# Altium schematic sheet CPU.SchDoc: CPU
size 420 x 297 mm; Author: G.K.; CompanyName: WUT; DrawnBy: G.K.; Organization: WUT ISE; Address1: Warsaw Univeristy of Technology; Address2: Nowowiejska 15/19; DocumentNumber: 2; Revision: -; SheetNumber: 2; SheetTotal: 5; EDA_Number: ARTIQ; Projet: 8 Channel RF Power Amplifier; ModifiedBy: -; CreateDate: XX/XX/XXXX; CheckedDate: -; Title2: controller; DivGrp: ISE; Designer: G.K.; ModifiedDate: -; ProjectName: 8 Channel RF Power Amplifier
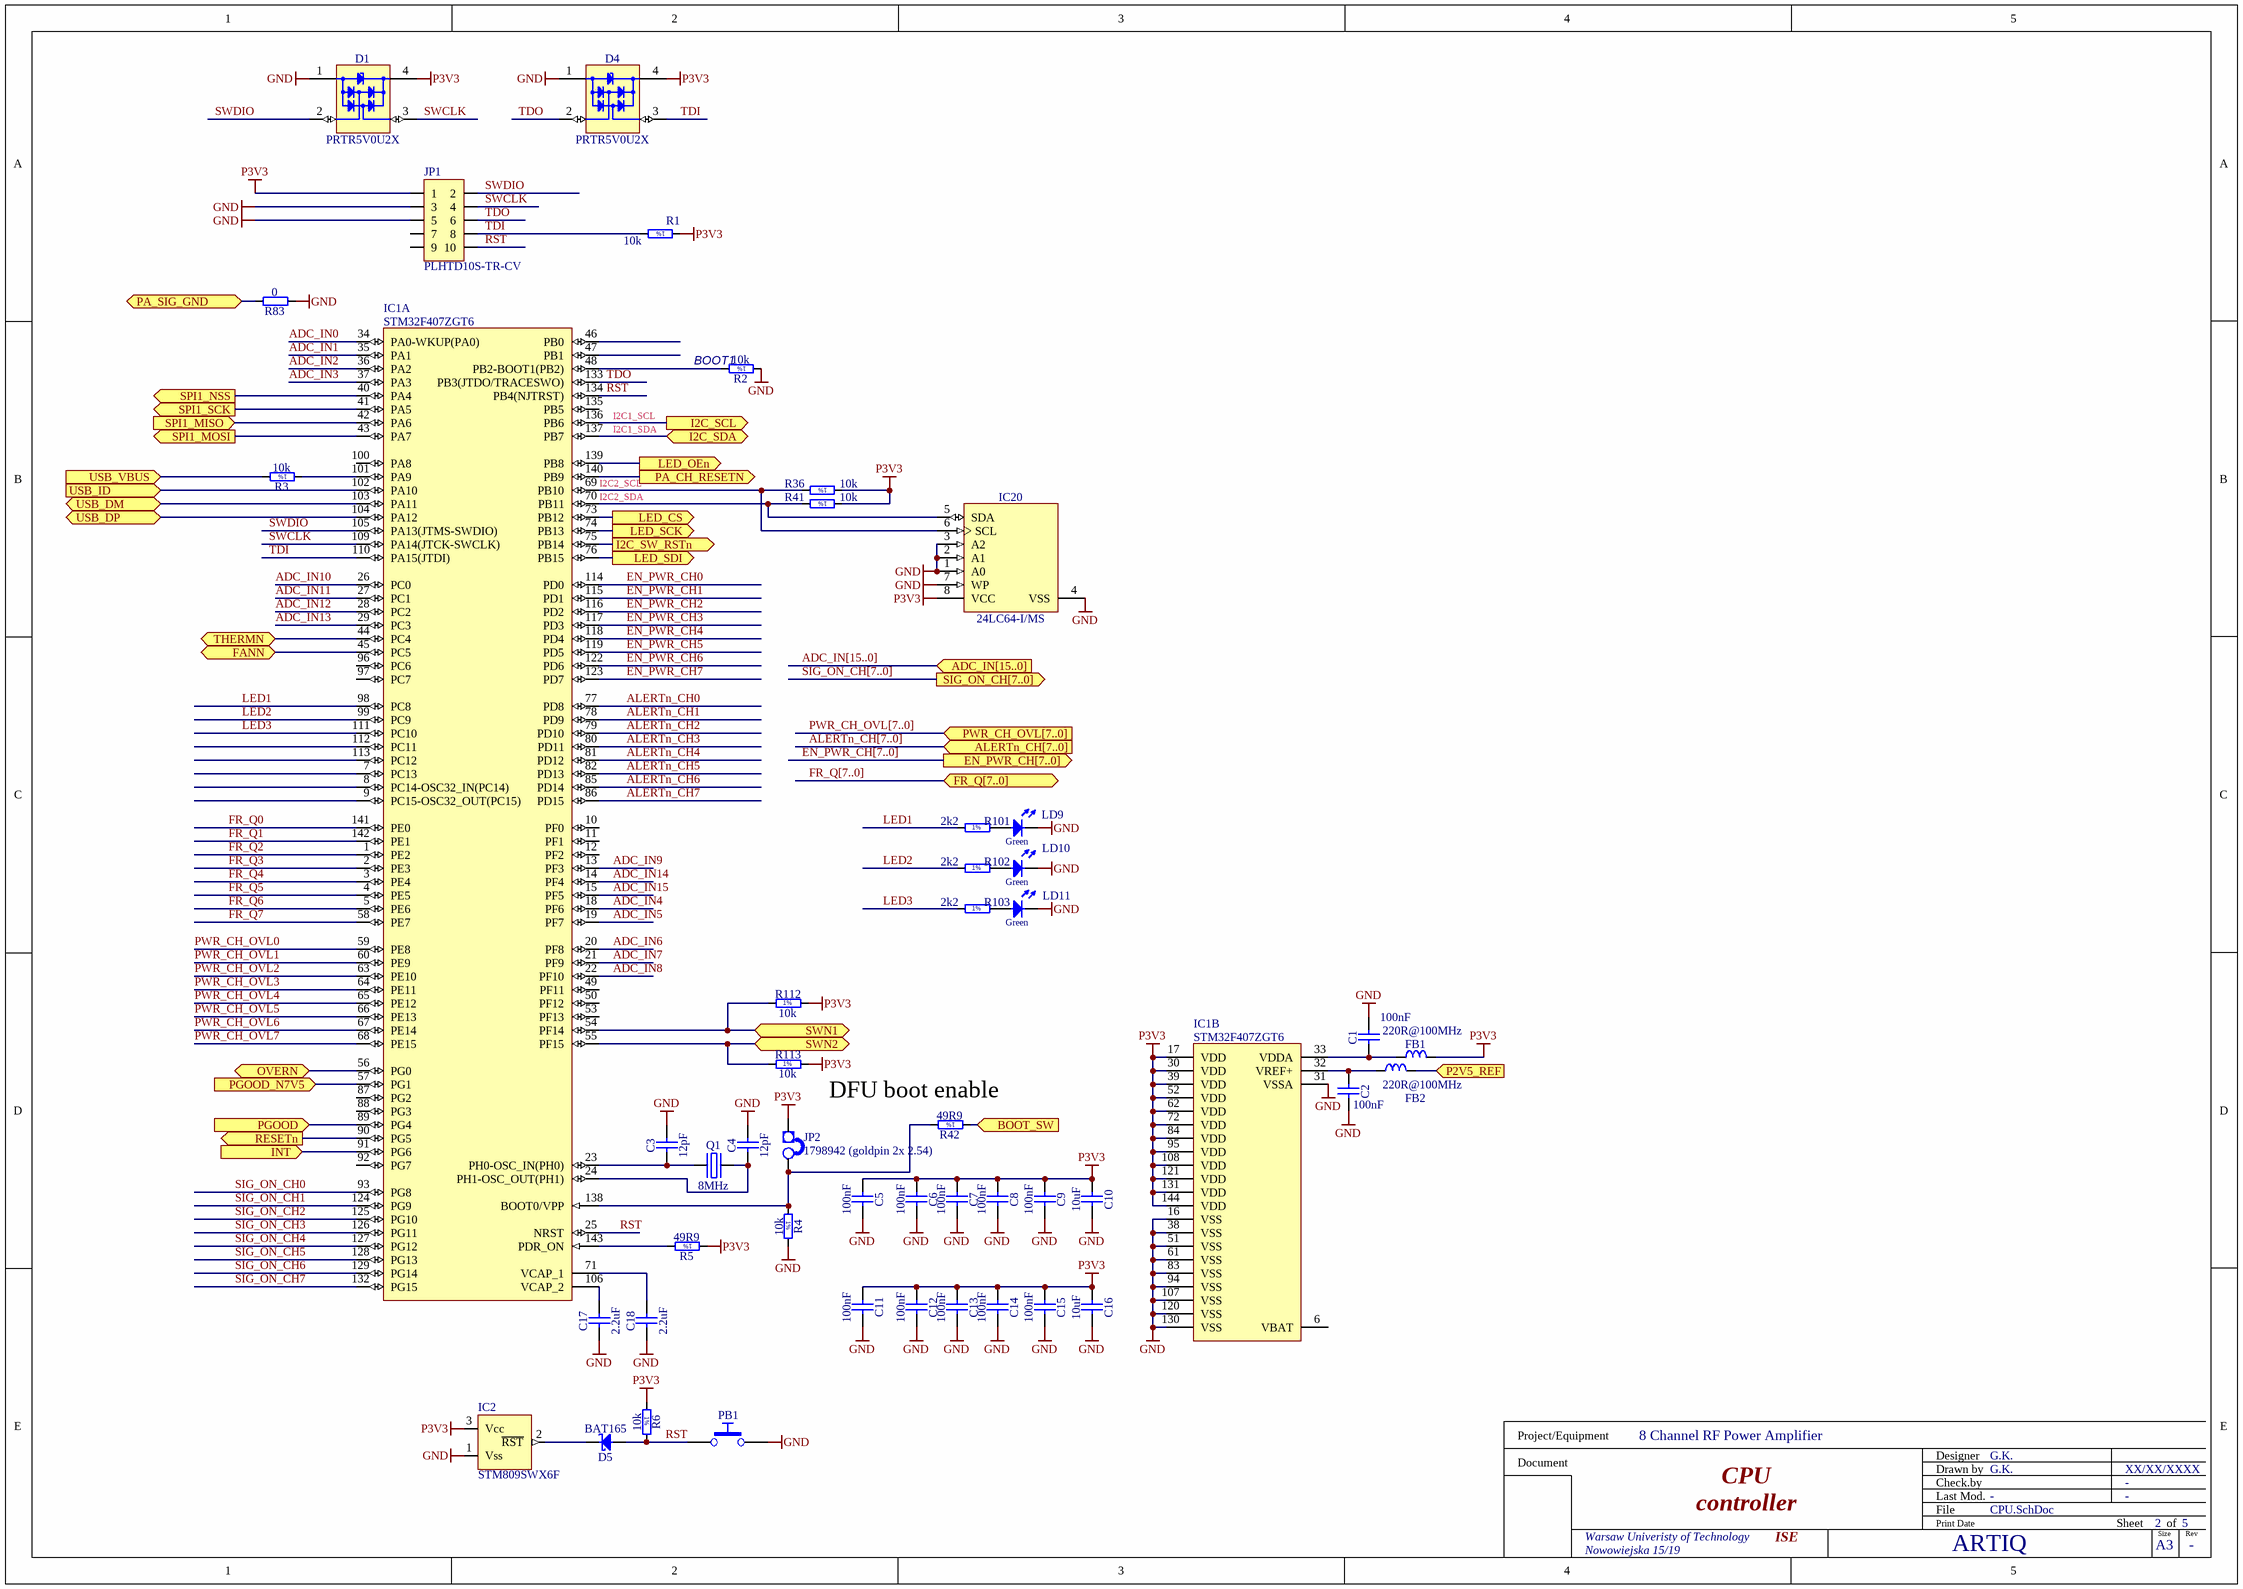
[diagram p0: CPU.SchDoc]

## Parts
C1  100nF  [CAPC1005X55N]
C2  100nF  [CAPC1005X55N]
C3  12pF  [CAPC1005X55N]
C4  12pF  [CAPC1005X55N]
C5  100nF  [CAPC1005X55N]
C6  100nF  [CAPC1005X55N]
C7  100nF  [CAPC1005X55N]
C8  100nF  [CAPC1005X55N]
C9  100nF  [CAPC1005X55N]
C10  10uF  [CAPC2012X135N]
C11  100nF  [CAPC1005X55N]
C12  100nF  [CAPC1005X55N]
C13  100nF  [CAPC1005X55N]
C14  100nF  [CAPC1005X55N]
C15  100nF  [CAPC1005X55N]
C16  10uF  [CAPC2012X135N]
C17  2.2uF  [CAPC1608X90N]
C18  2.2uF  [CAPC1608X90N]
D1  PRTR5V0U2X  [SOT190P230X110-4N]
D4  PRTR5V0U2X  [SOT190P230X110-4N]
D5  BAT165  [SOD2512X110N]
FB1  220R@100MHz  [INDC2012X105N]
FB2  220R@100MHz  [INDC2012X105N]
IC1  STM32F407ZGT6  [QFP50P2200X2200X160-144N]  (parts A,B of 2)
IC2  STM809SWX6F  [SOT-23]
IC20  24LC64-I/MS  [SOP65P490X110-8N]
JP1  PLHTD10S-TR-CV  [PLHTD10S-TR-CV]
JP2  1798942 (goldpin 2x 2.54)  [jump]
LD9  Green  [LED_OSRAM_LGL29K]  (value not drawn)
LD10  Green  [LED_OSRAM_LGL29K]  (value not drawn)
LD11  Green  [LED_OSRAM_LGL29K]  (value not drawn)
PB1  Push Button  [PB_TYCO_FSMSM]  (value not drawn)
Q1  8MHz  [XTAL_TXC_7A]
R1  10k  [RESC1005X40N]
R2  10k  [RESC1005X40N]
R3  10k  [RESC1005X40N]
R4  10k  [RESC1005X40N]
R5  49R9  [RESC1005X40N]
R6  10k  [RESC1005X40N]
R36  10k  [RESC1005X40N]
R41  10k  [RESC1005X40N]
R42  49R9  [RESC1005X40N]
R83  0  [RESC1005X40N]
R101  2k2  [RESC1005X40N]
R102  2k2  [RESC1005X40N]
R103  2k2  [RESC1005X40N]
R112  10k  [RESC1005X40N]
R113  10k  [RESC1005X40N]

## Ports
ADC_IN[15..0] (in), ALERTn_CH[7..0] (in), BOOT_SW (in), EN_PWR_CH[7..0] (out), FANN, FR_Q[7..0] (bidir), I2C_SCL (out), I2C_SDA (bidir), I2C_SW_RSTn (out), INT (in), LED_CS (out), LED_OEn (out), LED_SCK (out), LED_SDI (out), OVERN, P2V5_REF (in), PA_CH_RESETN (out), PA_SIG_GND (bidir), PGOOD (in), PGOOD_N7V5 (in), PWR_CH_OVL[7..0] (in), RESETn (out), SIG_ON_CH[7..0] (out), SPI1_MISO (in), SPI1_MOSI (out), SPI1_NSS (out), SPI1_SCK (out), SWN1 (bidir), SWN2 (bidir), THERMN, USB_DM (bidir), USB_DP (bidir), USB_ID (in), USB_VBUS (in)

## Nets
GND: C1.2 C2.2 C3.2 C4.2 C5.2 C6.2 C7.2 C8.2 C9.2 C10.2 C11.2 C12.2 C13.2 C14.2 C15.2 C16.2 C17.1 C18.1 D1.1(GND) D4.1(GND) IC1.16(VSS) IC1.31(VSSA) IC1.38(VSS) IC1.51(VSS) IC1.61(VSS) IC1.83(VSS) IC1.94(VSS) IC1.107(VSS) IC1.120(VSS) IC1.130(VSS) IC2.1(Vss) IC20.1(A0) IC20.2(A1) IC20.3(A2) IC20.4(VSS) IC20.7(WP) JP1.3 JP1.5 LD9.1(C) LD10.1(C) LD11.1(C) PB1.2 R2.1 R4.2 R83.1
P3V3: C5.1 C6.1 C7.1 C8.1 C9.1 C10.1 C11.1 C12.1 C13.1 C14.1 C15.1 C16.1 D1.4(VCC) D4.4(VCC) FB1.2 IC1.17(VDD) IC1.30(VDD) IC1.39(VDD) IC1.52(VDD) IC1.62(VDD) IC1.72(VDD) IC1.84(VDD) IC1.95(VDD) IC1.108(VDD) IC1.121(VDD) IC1.131(VDD) IC1.144(VDD) IC2.3(Vcc) IC20.8(VCC) JP1.1 JP2.1(E1) R1.1 R5.1 R6.1 R36.1 R41.1 R112.2 R113.2
ADC_IN0: IC1.34(PA0-WKUP(PA0))
ADC_IN1: IC1.35(PA1)
ADC_IN2: IC1.36(PA2)
ADC_IN3: IC1.37(PA3)
ADC_IN4: IC1.18(PF6)
ADC_IN5: IC1.19(PF7)
ADC_IN6: IC1.20(PF8)
ADC_IN7: IC1.21(PF9)
ADC_IN8: IC1.22(PF10)
ADC_IN9: IC1.13(PF3)
ADC_IN10: IC1.26(PC0)
ADC_IN11: IC1.27(PC1)
ADC_IN12: IC1.28(PC2)
ADC_IN13: IC1.29(PC3)
ADC_IN14: IC1.14(PF4)
ADC_IN15: IC1.15(PF5)
ALERTn_CH0: IC1.77(PD8)
ALERTn_CH1: IC1.78(PD9)
ALERTn_CH2: IC1.79(PD10)
ALERTn_CH3: IC1.80(PD11)
ALERTn_CH4: IC1.81(PD12)
ALERTn_CH5: IC1.82(PD13)
ALERTn_CH6: IC1.85(PD14)
ALERTn_CH7: IC1.86(PD15)
BOOT_SW: R42.1 ; port BOOT_SW
EN_PWR_CH0: IC1.114(PD0)
EN_PWR_CH1: IC1.115(PD1)
EN_PWR_CH2: IC1.116(PD2)
EN_PWR_CH3: IC1.117(PD3)
EN_PWR_CH4: IC1.118(PD4)
EN_PWR_CH5: IC1.119(PD5)
EN_PWR_CH6: IC1.122(PD6)
EN_PWR_CH7: IC1.123(PD7)
FANN: IC1.45(PC5) ; port FANN
FR_Q0: IC1.141(PE0)
FR_Q1: IC1.142(PE1)
FR_Q2: IC1.1(PE2)
FR_Q3: IC1.2(PE3)
FR_Q4: IC1.3(PE4)
FR_Q5: IC1.4(PE5)
FR_Q6: IC1.5(PE6)
FR_Q7: IC1.58(PE7)
I2C_SCL: IC1.136(PB6) ; port I2C_SCL
I2C_SDA: IC1.137(PB7) ; port I2C_SDA
I2C_SW_RSTn: IC1.75(PB14) ; port I2C_SW_RSTn
INT: IC1.91(PG6) ; port INT
LED1: IC1.98(PC8) R101.1
LED2: IC1.99(PC9) R102.1
LED3: IC1.111(PC10) R103.1
LED_CS: IC1.73(PB12) ; port LED_CS
LED_OEn: IC1.139(PB8) ; port LED_OEn
LED_SCK: IC1.74(PB13) ; port LED_SCK
LED_SDI: IC1.76(PB15) ; port LED_SDI
OVERN: IC1.56(PG0) ; port OVERN
P2V5_REF: FB2.2 ; port P2V5_REF
PA_CH_RESETN: IC1.140(PB9) ; port PA_CH_RESETN
PA_SIG_GND: R83.2 ; port PA_SIG_GND
PGOOD: IC1.89(PG4) ; port PGOOD
PGOOD_N7V5: IC1.57(PG1) ; port PGOOD_N7V5
PWR_CH_OVL0: IC1.59(PE8)
PWR_CH_OVL1: IC1.60(PE9)
PWR_CH_OVL2: IC1.63(PE10)
PWR_CH_OVL3: IC1.64(PE11)
PWR_CH_OVL4: IC1.65(PE12)
PWR_CH_OVL5: IC1.66(PE13)
PWR_CH_OVL6: IC1.67(PE14)
PWR_CH_OVL7: IC1.68(PE15)
RESETn: IC1.90(PG5) ; port RESETn
RST: D5.2(A) IC1.25(NRST) IC1.134(PB4(NJTRST)) JP1.10 PB1.1 R6.2
SIG_ON_CH0: IC1.93(PG8)
SIG_ON_CH1: IC1.124(PG9)
SIG_ON_CH2: IC1.125(PG10)
SIG_ON_CH3: IC1.126(PG11)
SIG_ON_CH4: IC1.127(PG12)
SIG_ON_CH5: IC1.128(PG13)
SIG_ON_CH6: IC1.129(PG14)
SIG_ON_CH7: IC1.132(PG15)
SPI1_MISO: IC1.42(PA6) ; port SPI1_MISO
SPI1_MOSI: IC1.43(PA7) ; port SPI1_MOSI
SPI1_NSS: IC1.40(PA4) ; port SPI1_NSS
SPI1_SCK: IC1.41(PA5) ; port SPI1_SCK
SWCLK: D1.3(I/O2) IC1.109(PA14(JTCK-SWCLK)) JP1.4
SWDIO: D1.2(I/O1) IC1.105(PA13(JTMS-SWDIO)) JP1.2
SWN1: IC1.54(PF14) R112.1 ; port SWN1
SWN2: IC1.55(PF15) R113.1 ; port SWN2
TDI: D4.3(I/O2) IC1.110(PA15(JTDI)) JP1.8 R1.2
TDO: D4.2(I/O1) IC1.133(PB3(JTDO/TRACESWO)) JP1.6
THERMN: IC1.44(PC4) ; port THERMN
USB_DM: IC1.103(PA11) ; port USB_DM
USB_DP: IC1.104(PA12) ; port USB_DP
USB_ID: IC1.102(PA10) ; port USB_ID
USB_VBUS: R3.2 ; port USB_VBUS
NetC1_1: C1.1 FB1.1 IC1.33(VDDA)
NetC2_1: C2.1 FB2.1 IC1.32(VREF+)
NetC3_1: C3.1 IC1.23(PH0-OSC_IN(PH0)) Q1.1(OSC1)
NetC4_1: C4.1 IC1.24(PH1-OSC_OUT(PH1)) Q1.2(OSC2)
NetC17_2: C17.2 IC1.106(VCAP_2)
NetC18_2: C18.2 IC1.71(VCAP_1)
NetD5_1: D5.1(C) IC2.2(~{RST})
NetIC1_48: IC1.48(PB2-BOOT1(PB2)) R2.2
NetIC1_69: IC1.69(PB10) IC20.6(SCL) R36.2
NetIC1_70: IC1.70(PB11) IC20.5(SDA) R41.2
NetIC1_101: IC1.101(PA9) R3.1
NetIC1_138: IC1.138(BOOT0/VPP) JP2.2(E2) R4.1 R42.2
NetIC1_143: IC1.143(PDR_ON) R5.2
NetLD9_2: LD9.2(A) R101.2
NetLD10_2: LD10.2(A) R102.2
NetLD11_2: LD11.2(A) R103.2

Not connected (* = marked no-connect by the designer): IC1 6(VBAT) 7(PC13) 8(PC14-OSC32_IN(PC14)) 9(PC15-OSC32_OUT(PC15)) 10(PF0) 11(PF1) 12(PF2) 46(PB0) 47(PB1) 49(PF11) 50(PF12) 53(PF13) 87(PG2) 88(PG3) 92(PG7) 96(PC6) 97(PC7) 100(PA8) 112(PC11) 113(PC12) 135(PB5); JP1 7 9

## Buses and harness runs
bus ADC_IN[15..0] = port ADC_IN[15..0]
bus ALERTn_CH[7..0] = port ALERTn_CH[7..0]
bus EN_PWR_CH[7..0] = port EN_PWR_CH[7..0]
bus FR_Q[7..0] = port FR_Q[7..0]
bus PWR_CH_OVL[7..0] = port PWR_CH_OVL[7..0]
bus SIG_ON_CH[7..0] = port SIG_ON_CH[7..0]

## Notes on the sheet
- (near R2) BOOT1
- (near IC1) I2C1_SCL
- (near IC1) I2C1_SDA
- (near IC1) I2C2_SCL
- (near IC1) I2C2_SDA
- DFU boot enable
- Project/Equipment
- Document
- Designer
- Drawn by
- Check.by
- File
- Last Mod.
- Print Date
- Sheet
- Size
- A3
- of
- Rev
- (in symbol R0402_2K2_1%_0.0625W_100PPM) 1%
- (in symbol R0402_10K_1%_0.0625W_100PPM) 1%
- (in symbol R0402_49R9_1%_0.0625W_100PPM) 1%

## Library data of the parts
C1 C2 C5-C9 C11-C15 = CC0402_100NF_16V_10%_X7R: Non-polarised capacitor; Part Description: SMD Multilayer Chip Ceramic Capacitor; Manufacturer: GENERIC; Manufacturer1 Part Number: GRM155R71C104KA88D; Voltage: 16V; TC: X7R; Tolerance: ±10%; Part Number: CC0402_100NF_16V_10%_X7R; Component Kind: Standard; Component Type: Standard; Pin Count: 2; Value: 100nF; Status: Not Recommended; Manufacturer Part Number: CC0402_100NF_16V_10%_X7R; Case: 0402; Mounted: Yes; Socket: No; SMD: Yes; Manufacturer1 Example: MURATA; Manufacturer1 ComponentHeight: 0.55mm; HelpURL: \\cern.ch\dfs\Applications\Altium\Datasheets\CC0402_X7R_MURATA_GRM.pdf; Author: CERN DEM JLC; CreateDate: 05.12.2013; LatestRevisionDate: 03.12.2007; Sense: No
C3 C4 = CC0402_12PF_50V_5%_C0G: Non-polarised capacitor; Part Description: SMD Multilayer Chip Ceramic Capacitor; Manufacturer: GENERIC; Manufacturer1 Part Number: C0402C120J5GACTU; Voltage: 50V; TC: C0G/NP0; Tolerance: ±5%; Part Number: CC0402_12PF_50V_5%_C0G; Component Kind: Standard; Component Type: Standard; Pin Count: 2; Value: 12pF; Status: Preferred; Manufacturer Part Number: CC0402_12PF_50V_5%_C0G; Case: 0402; Mounted: Yes; Socket: No; SMD: Yes; Sense: No; Manufacturer1 Example: KEMET; Manufacturer1 ComponentHeight: 0.55mm; HelpURL: \\cern.ch\dfs\Applications\Altium\Datasheets\CC0805_C0G_KEMET_(Commercial Grade).pdf; Author: CERN DEM JLC; CreateDate: 04.10.2016; LatestRevisionDate: 04.10.2016
C10 C16 = CC0805_10UF_16V_10%_X5R: Non-polarised capacitor; Part Description: SMD Multilayer Chip Ceramic Capacitor; Manufacturer: GENERIC; Manufacturer1 Part Number: C0805C106K4PAC; Voltage: 16V; TC: X5R; Tolerance: ±10%; Part Number: CC0805_10UF_16V_10%_X5R; Component Kind: Standard; Component Type: Standard; Pin Count: 2; Value: 10uF; Status: Preferred; Manufacturer Part Number: CC0805_10UF_16V_10%_X5R; Case: 0805; Mounted: Yes; Socket: No; SMD: Yes; Manufacturer1 Example: KEMET; Manufacturer1 ComponentHeight: 1.4mm; HelpURL: \\cern.ch\dfs\Applications\Altium\Datasheets\CC1206_X5R_KEMET.pdf; Author: CERN DEM JLC; CreateDate: 03.12.2007; LatestRevisionDate: 03.12.2007; Sense: No
C17 C18 = CC0603_2.2UF_10V_20%_X7R: Non-polarised capacitor; Part Description: SMD Multilayer Chip Ceramic Capacitor; Manufacturer: GENERIC; Manufacturer1 Part Number: LMK107B7225MA-T; Voltage: 10V; TC: X7R; Tolerance: ±20%; Part Number: CC0603_2.2UF_10V_20%_X7R; Component Kind: Standard; Component Type: Standard; Pin Count: 2; Value: 2.2uF; Status: Not Recommended; Manufacturer Part Number: CC0603_2.2UF_10V_20%_X7R; Case: 0603; Mounted: Yes; Socket: No; SMD: Yes; Sense: No; Manufacturer1 Example: TAIYO YUDEN; Manufacturer1 ComponentHeight: 0.9mm; HelpURL: \\cern.ch\dfs\Applications\Altium\Datasheets\CC0603_X7R_TAIYO-YUDEN_HIGH-VALUE.pdf; Author: CERN DEM JLC; CreateDate: 22.06.2011; LatestRevisionDate: 27.06.2011
D1 D4 = PRTR5V0U2X: Ultra Low Capacitance Double Rail-to-Rail ESD Protection Diode; Part Description: Ultra Low Capacitance (1pF) Double Rail-to-Rail ESD Protection Diode (8kV); Manufacturer: NXP SEMICONDUCTORS; Voltage: 5.5V; PressFit: No; Bonding: No; Part Number: PRTR5V0U2X; Component Kind: Standard; Component Type: Standard; Device: PRTR5V0U2X; PackageDescription: SOT143B, SOT, 1.90mm Pitch; 4 Pin, 1.30mm W X 2.90mm L X 1.10mm H body, IPC Medium Density; Manufacturer Part Number: PRTR5V0U2X; Pin Count: 4; Case: SOT143B; Mounted: Yes; Socket: No; SMD: Yes; Sense: No; ComponentHeight: 1.1mm; HelpURL: \\cern.ch\dfs\Applications\Altium\Datasheets\PRTR5V0U2X.pdf; Author: CERN DEM JLC; CreateDate: 22.03.2011; LatestRevisionDate: 22.03.2011
D5 = BAT165: Schottky Diode; Part Description: Medium Power AF Schottky Diode; Manufacturer: INFINEON; Voltage: 40V; Power: 750mA; PressFit: No; Bonding: No; Part Number: BAT165; Component Kind: Standard; Component Type: Standard; Device: BAT165; PackageDescription: Small Outline Diode Flat Lead (SOD-323), 1.70mm W X 1.25mm L X 1.10mm H body,  IPC Medium Density; Manufacturer Part Number: BAT165; Pin Count: 2; Case: SOD323; Mounted: Yes; Socket: No; SMD: Yes; Sense: No; ComponentHeight: 1.1mm; HelpURL: \\cern.ch\dfs\Applications\Altium\Datasheets\BAT165.pdf; Author: CERN DEM JLC; CreateDate: 12.11.2014; LatestRevisionDate: 12.11.2014
FB1 FB2 = IND0805_MURATA_BLM21PG221SN1D: Inductor; Part Description: SMD EMIFIL Suppression Chip Ferrite Bead; Manufacturer: MURATA; Power: 2A; Resistance: 0.05R; Tolerance: ±25%; Table: Inductors SMD; Part Number: IND0805_MURATA_BLM21PG221SN1D; Component Kind: Standard; Component Type: Standard; Pin Count: 2; Value: 220R@100MHz; Status: None; Manufacturer Part Number: BLM21PG221SN1D; Case: 0805; Mounted: Yes; Socket: No; SMD: Yes; ComponentHeight: 1.05mm; HelpURL: \\cern.ch\dfs\Applications\Altium\Datasheets\IND0402_MURATA_BLM21P.pdf; Author: CERN DEM JLC; CreateDate: 2010-01-25; LatestRevisionDate: 2010-01-25
IC1 = STM32F407ZGT6: ARM Cortex-M4 32-bit MCU+FPU, 210 DMIPS, 1024 kB Flash, 192 kB Internal RAM, 114 I/Os, 144-pin LQFP, -40 to 85 degC, Tray; Part Description: ARM Cortex-M4 32b MCU+FPU, 210DMIP, 1024 kB Flash, 192+4 kB RAM, Camera, 114 I/Os, 144-pin LQFP, Industrial Grade; Manufacturer: ST MICROELECTRONICS; PressFit: No; Bonding: No; Part Number: STM32F407ZGT6; Component Kind: Standard; Component Type: Standard; Device: STM32F407ZGT6; PackageDescription: QFP, 0.50mm Pitch, Square; 144 Pin, 20.00mm L X 20.00mm W X 1.60mm H Body, IPC Medium Density; Manufacturer Part Number: STM32F407ZGT6; Pin Count: 144; Case: QFP144; Mounted: Yes; Socket: No; SMD: Yes; Sense: No; ComponentHeight: 1.6mm; HelpURL: \\cern.ch\dfs\Applications\Altium\Datasheets\STM32F407ZGT6.pdf; Author: CERN DEM MR; CreateDate: 14.07.2016; LatestRevisionDate: 14.07.2016
IC2 = VMON_STM809: 2.93V  Reset circuit
IC20 = 24LC64-I/MS: 64K I2C Serial EEPROM; Part Description: 2.5V-5.5V, 64K (8K x 8-bit) I2C Serial EEPROM; Manufacturer: MICROCHIP TECHNOLOGY; PressFit: No; Bonding: No; Part Number: 24LC64-I/MS; Component Kind: Standard; Component Type: Standard; Device: 24LC64-I/MS; PackageDescription: SOP, 0.65mm pitch; 8 pin, 3.00mm W X 3.00mm L X 1.10mm H body, IPC Medium Density; Manufacturer Part Number: 24LC64-I/MS; Pin Count: 8; Case: MSOP8; Mounted: Yes; Socket: No; SMD: Yes; Sense: No; ComponentHeight: 1.1mm; HelpURL: \\cern.ch\dfs\Applications\Altium\Datasheets\24LC64-I-MS.pdf; Author: CERN DEM JLC; CreateDate: 24.01.2011; LatestRevisionDate: 24.01.2011
JP1 = CON_2x5 1.27 SMT Male: 1.27 mm dual row goldpin (Maritex)
JP2 = JUMPER: Supplier 1: Farnell; Supplier Part Number 1: 1798942
LD9-LD11 = LED_OSRAM_LG L29K-G2J1-24-Z: LED Green 1C 2A; Part Description: Surface Mount Green LED (0603 Case); Manufacturer: OSRAM; PressFit: No; Bonding: No; Part Number: LED_OSRAM_LG L29K-G2J1-24-Z; Component Kind: Standard; Component Type: Standard; Color: Green; PackageDescription: Green Chip LED, 2-Leads, Body 1.7x0.8mm, IPC Medium Density; Manufacturer Part Number: LG L29K-G2J1-24-Z; Pin Count: 2; Case: 0603; Mounted: Yes; Socket: No; SMD: Yes; Sense: No; ComponentHeight: 0.67mm; HelpURL: \\cern.ch\dfs\Applications\Altium\Datasheets\LED_OSRAM_LGL29K.pdf; Author: CERN DEM JLC; CreateDate: 24.04.2012; LatestRevisionDate: 24.04.2012
PB1 = PB_TYCO_FSMSM: Push-Button Switch SPDT; Part Description: 12VDC 50mA SPST Tactile  Push-Button Switch; Manufacturer: TYCO ELECTRONICS; Manufacturer Part Number: FSMSM or 1437566-3; PressFit: No; Part Number: PB_TYCO_FSMSM; Component Kind: Standard; Component Type: Standard; Pin Count: 2; PackageDescription: Body 3.5x6.0mm, Pushbutton Switch,  TYCO ALCOSWITCH FSMSM Serie; Family: Push Button; Mounted: Yes; Socket: No; SMD: Yes; Sense: No; Status: None; ComponentHeight: 4.3mm; HelpURL: \\cern.ch\dfs\Applications\Altium\Datasheets\PB_TYCO_FSMSM.pdf; Author: CERN DEM JLC; CreateDate: 30.06.2008; LatestRevisionDate: 21.06.2012
Q1 = XTAL_8MHZ_TXC_7A-8.000MAAE-T: Quartz Crystal; Part Description: Tolerance: ±30ppm, Stability: ±30ppm, -20°C to +70°C, 12pF, SMD Glass Seam Sealing Crystal, 7A Series; Manufacturer: TXC CORPORATION; PressFit: No; Bonding: No; Part Number: XTAL_8MHZ_TXC_7A-8.000MAAE-T; Component Kind: Standard; Component Type: Standard; PackageDescription: 2 Pins, 3.2x5mm, SMD Glass Seam Sealing Crystal, 7A Serie; Value: 8MHz; Manufacturer Part Number: 7A-8.000MAAE-T; Pin Count: 2; Mounted: Yes; Socket: No; SMD: Yes; Sense: No; ComponentHeight: 1.2mm; HelpURL: \\cern.ch\dfs\Applications\Altium\Datasheets\XTAL_TXC_7A.pdf; Author: CERN DEM JLC; CreateDate: 09.10.2014; LatestRevisionDate: 12.11.2014
R1-R4 R6 R36 R41 R112 R113 = R0402_10K_1%_0.0625W_100PPM: Resistor - 1%; Part Description: General Purpose Thick Film Chip Resistor; Manufacturer: GENERIC; Manufacturer1 Part Number: 232270671003L; TC: ±100ppm/°C; Table: Resistors SMD; Part Number: R0402_10K_1%_0.0625W_100PPM; Component Kind: Standard; Component Type: Standard; Pin Count: 2; Value: 10k; Status: Not recommended; Power: 0.0625W; Tolerance: ±1%; Manufacturer Part Number: R0402_10K_1%_0.0625W_100PPM; Case: 0402; Mounted: Yes; Socket: No; SMD: Yes; Manufacturer1 Example: YAGEO PHYCOMP; Manufacturer1 ComponentHeight: 0.4mm; HelpURL: \\cern.ch\dfs\Applications\Altium\Datasheets\R0402_Phycomp_RC0402.pdf; Author: CERN DEM JLC; CreateDate: 2007-12-03; LatestRevisionDate: 2012-10-17
R5 R42 = R0402_49R9_1%_0.0625W_100PPM: Resistor - 1%; Part Description: General Purpose Thick Film Chip Resistor; Manufacturer: GENERIC; Manufacturer1 Part Number: 232270674999L or RC0402FR-0749R9L; TC: ±100ppm/°C; Table: Resistors SMD; Part Number: R0402_49R9_1%_0.0625W_100PPM; Component Kind: Standard; Component Type: Standard; Pin Count: 2; Value: 49R9; Status: Not recommended; Power: 0.0625W; Tolerance: ±1%; Manufacturer Part Number: R0402_49R9_1%_0.0625W_100PPM; Case: 0402; Mounted: Yes; Socket: No; SMD: Yes; Manufacturer1 Example: YAGEO PHYCOMP; Manufacturer1 ComponentHeight: 0.4mm; HelpURL: \\cern.ch\dfs\Applications\Altium\Datasheets\R0402_Phycomp_RC0402.pdf; Author: CERN DEM JLC; CreateDate: 2012-10-24; LatestRevisionDate: 2012-10-24
R83 = R0402_0R_JUMPER: Resistor; Part Description: 1A (0.05R Max DC Resistance) Zero Ohm Jumper; Manufacturer: GENERIC; Manufacturer1 Part Number: 232270591001L; Part Number: R0402_0R_JUMPER; Component Kind: Standard; Component Type: Standard; Pin Count: 2; Value: 0; Status: Not recommended; Manufacturer Part Number: R0402_0R_JUMPER; Case: 0402; Mounted: Yes; Sense: No; Socket: No; SMD: Yes; Manufacturer1 Example: YAGEO PHYCOMP; Manufacturer1 ComponentHeight: 0.4mm; HelpURL: \\cern.ch\dfs\Applications\Altium\Datasheets\R0402_Phycomp_RC0402.pdf; Author: CERN DEM JLC; CreateDate: 03.12.2007; LatestRevisionDate: 17.10.2012
R101-R103 = R0402_2K2_1%_0.0625W_100PPM: Resistor - 1%; Part Description: General Purpose Thick Film Chip Resistor; Manufacturer: GENERIC; Manufacturer1 Part Number: 232270672202L; TC: ±100ppm/°C; Part Number: R0402_2K2_1%_0.0625W_100PPM; Component Kind: Standard; Component Type: Standard; Pin Count: 2; Value: 2k2; Status: Not recommended; Power: 0.0625W; Tolerance: ±1%; Manufacturer Part Number: R0402_2K2_1%_0.0625W_100PPM; Case: 0402; Mounted: Yes; Sense: No; Socket: No; SMD: Yes; Manufacturer1 Example: YAGEO PHYCOMP; Manufacturer1 ComponentHeight: 0.4mm; HelpURL: \\cern.ch\dfs\Applications\Altium\Datasheets\R0402_Phycomp_RC0402.pdf; Author: CERN DEM JLC; CreateDate: 03.12.2007; LatestRevisionDate: 17.10.2012